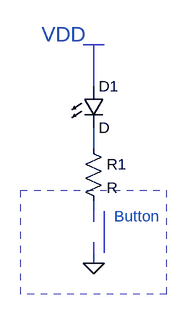
[diagram p0: schematic task2.asc]
task2.asc, the LTspice schematic file:
Version 4
SHEET 1 880 680
WIRE 96 -32 96 -48
WIRE 96 48 96 16
WIRE 96 144 96 128
WIRE 96 224 96 208
FLAG 96 224 0
SYMBOL LED 80 -48 R0
SYMATTR InstName D1
SYMBOL res 80 32 R0
SYMATTR InstName R1
TEXT 16 -128 Left 3 ;VDD
TEXT 128 152 Left 2 ;Button
LINE Normal 96 -112 96 -48
LINE Normal 80 -112 96 -112
LINE Normal 112 -112 80 -112
LINE Normal 112 -112 112 -112 2
LINE Normal 112 -112 112 -112 2
LINE Normal 96 160 96 144
LINE Normal 96 160 96 160 2
LINE Normal 96 160 96 160 2
LINE Normal 96 192 96 208
LINE Normal 96 192 96 192 2
LINE Normal 112 208 112 144
LINE Normal 112 208 112 208 2
LINE Normal 112 208 112 208 2
RECTANGLE Normal 208 272 -16 112 2

The netlist it stands for:
* task2.asc
D1 N001 N002 D
R1 N002 N003 R
.model D D
.lib standard.dio
* VDD
* Button
.backanno
.end